# EAGLE design ACCUM (EAGLE 9.3.2)
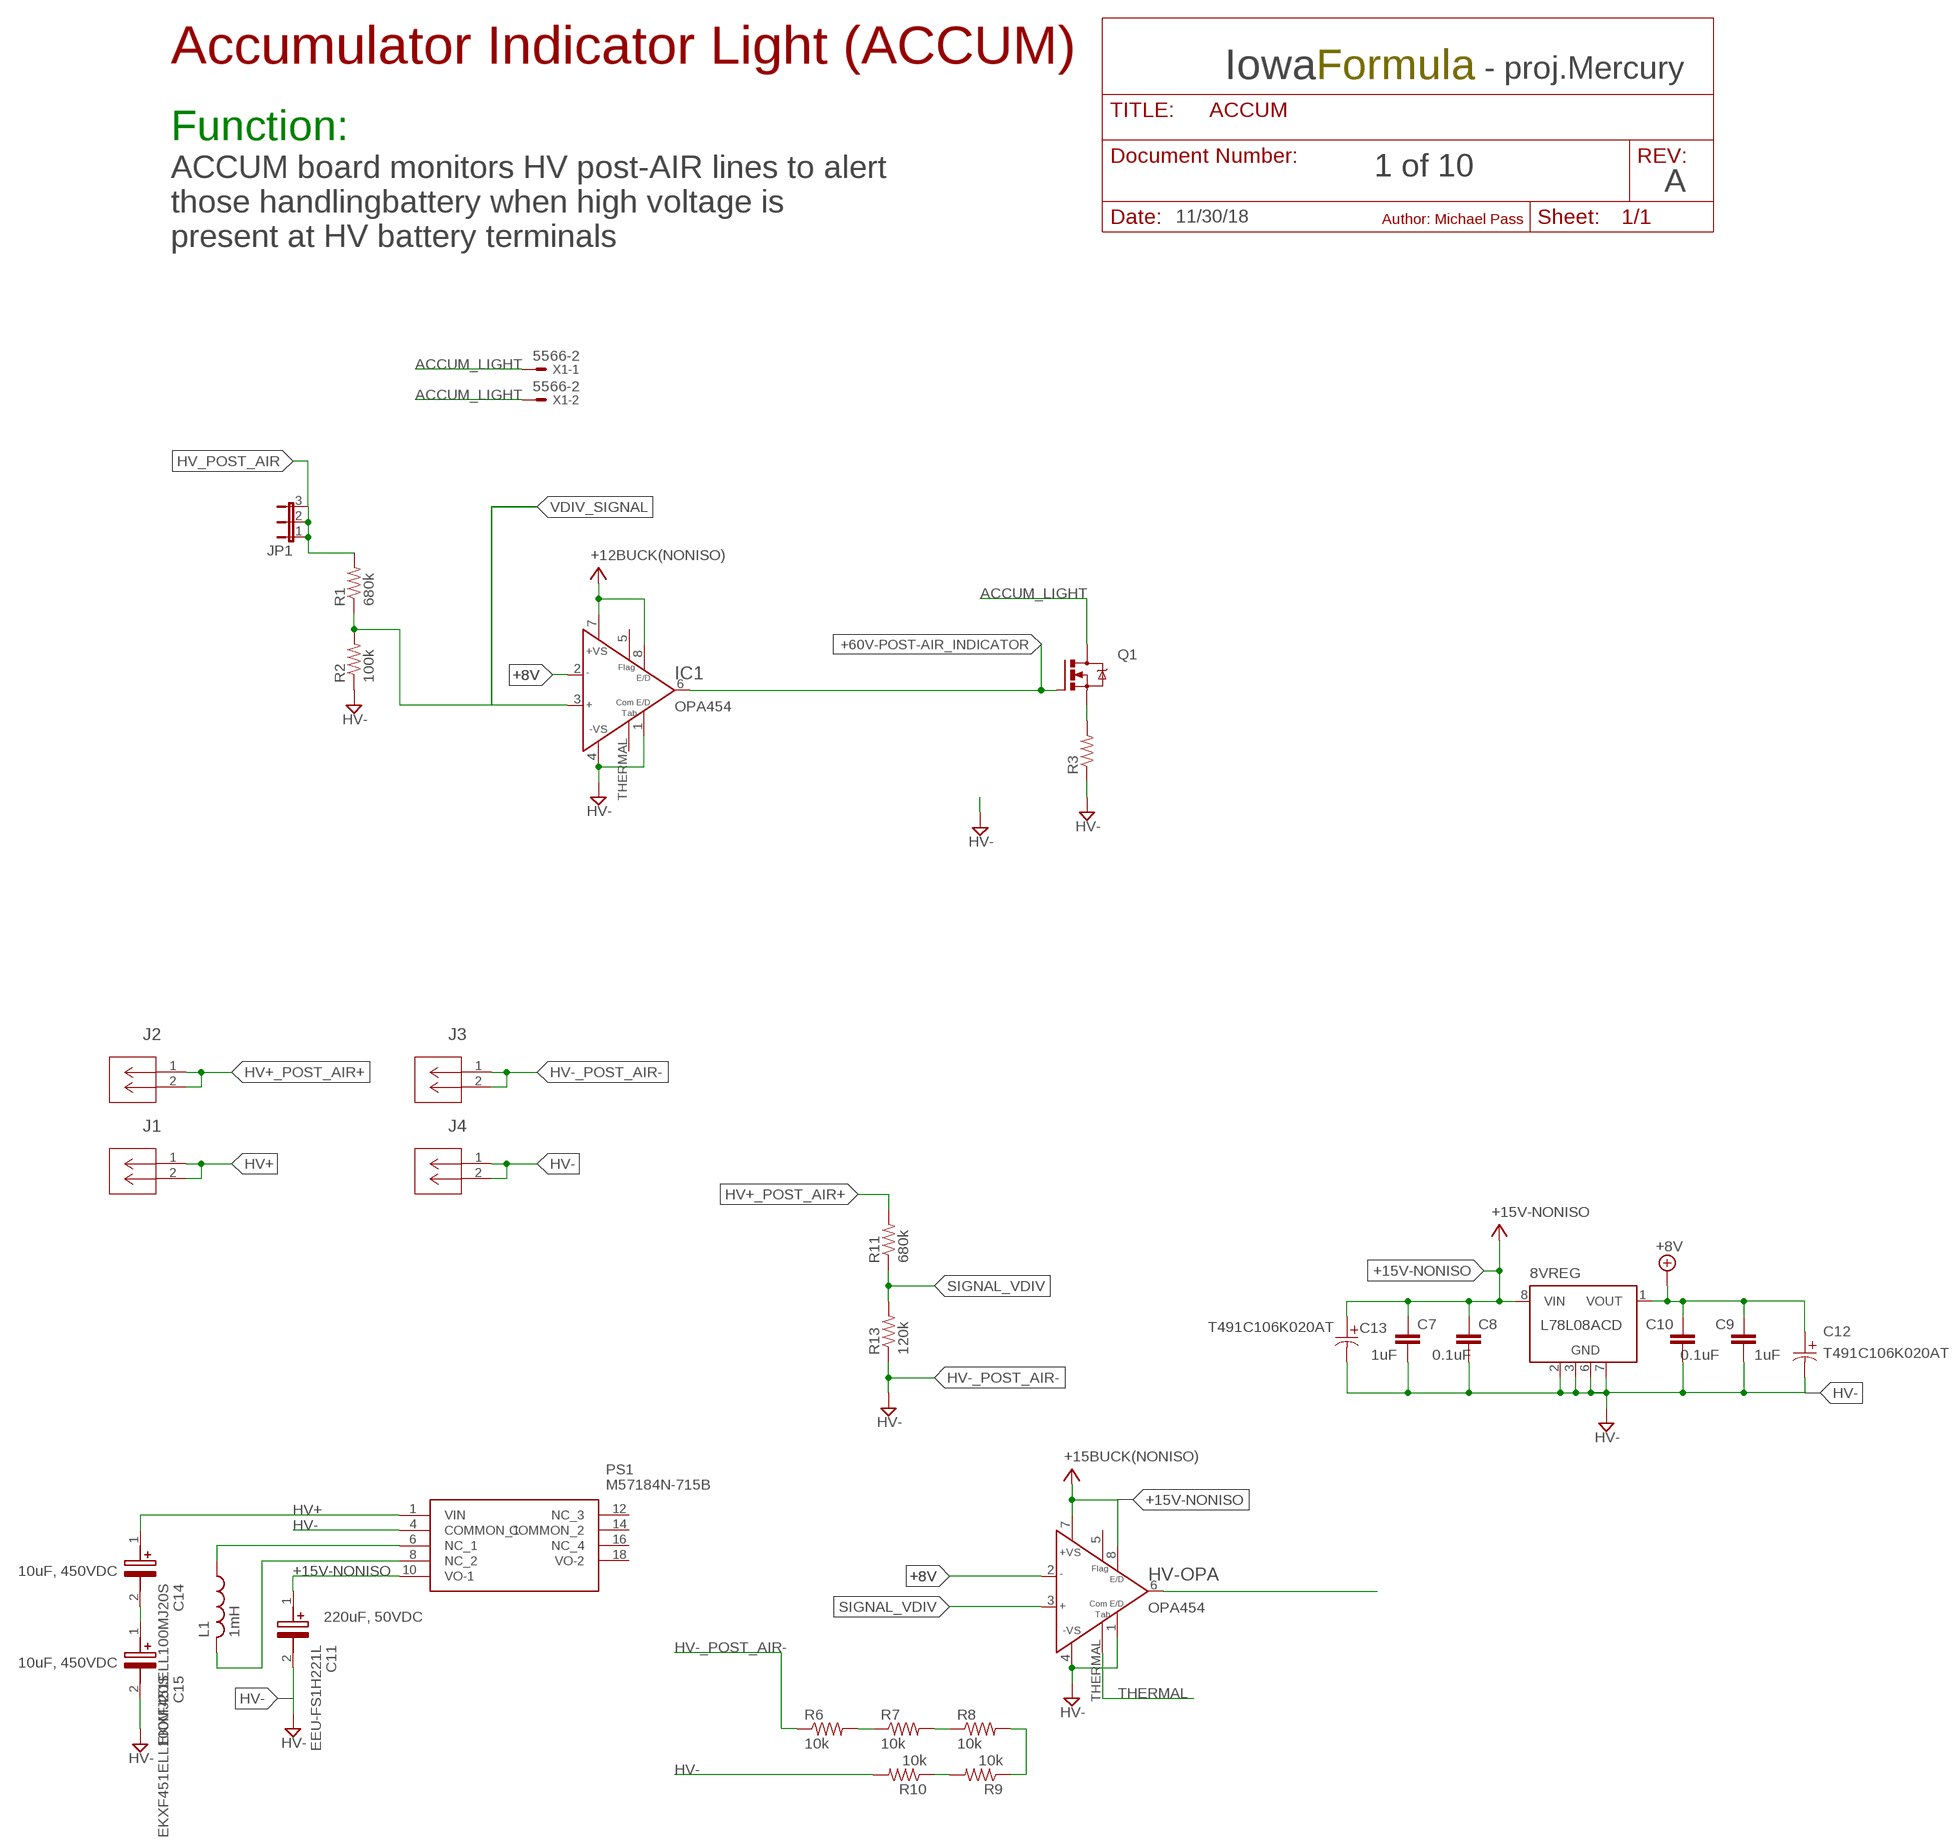
[diagram p0: schematic, sheet 1]

## Parts
8VREG  L78L08ACD  78L08SMD  [SO08]
C7  1uF  C-EUC0805  [C0805]
C8  0.1uF  C-EUC0805  [C0805]
C9  1uF  C-EUC0805  [C0805]
C10  0.1uF  C-EUC0805  [C0805]
C11  EEU-FS1H221L  [CAPPRD350W65D800H2200]
C12  T491C106K020AT  [CAPT6032N]
C13  T491C106K020AT  [CAPT6032N]
C14  EKXF451ELL100MJ20S  [CAPPRD500W60D1025H2150]
C15  EKXF451ELL100MJ20S  [CAPPRD500W60D1025H2150]
HV-OPA  OPA454  [SO08GP]
IC1  OPA454  [SO08GP]
J1  2P_1-770166-0  [CON2_1X2_P163_VMNL-1MTG]
J2  2P_1-770166-0  [CON2_1X2_P163_VMNL-1MTG]
J3  2P_1-770166-0  [CON2_1X2_P163_VMNL-1MTG]
J4  2P_1-770166-0  [CON2_1X2_P163_VMNL-1MTG]
JP1  JP2W  [JP2W]
L1  1mH  L-USL2012C  [L2012C]
PS1  M57184N-715B  [M57184N715B]
Q1  IRLZ44Z  [TO220BH]
R1  680k  R-US_R0805  [R0805]
R2  100k  R-US_R0805  [R0805]
R3  R-US_R0805  [R0805]
R6  10k  R-US_R0805  [R0805]
R7  10k  R-US_R0805  [R0805]
R8  10k  R-US_R0805  [R0805]
R9  10k  R-US_R0805  [R0805]
R10  10k  R-US_R0805  [R0805]
R11  680k  R-US_R0805  [R0805]
R13  120k  R-US_R0805  [R0805]
X1  5566-2  [5566-2]

## Nets
+8V: 8VREG.1(VOUT) C9.1 C10.1 C12.1 HV-OPA.2(IN-) IC1.2(IN-)
+15V-NONISO: 8VREG.8(VIN) C7.1 C8.1 C11.1(+) C13.1 HV-OPA.7(+VS) HV-OPA.8(E/D) PS1.10(VO-1) ; supply symbol labelled +15BUCK(NONISO)
+60V-POST-AIR_INDICATOR: IC1.6(OUT) Q1.G
ACCUM_LIGHT: Q1.D X1.1 X1.2
GND: R2.1 R3.1 ; supply symbol labelled HV-
HV+: C14.1(+) J1.1 J1.2 PS1.1(VIN)
HV+_POST_AIR+: J2.1 J2.2 R11.2
HV-: 8VREG.2(GND) 8VREG.3(GND) 8VREG.6(GND) 8VREG.7(GND) C7.2 C8.2 C9.2 C10.2 C11.2(-) C12.2 C13.2 C15.2(-) HV-OPA.1(E/DCOM) HV-OPA.4(-VS) IC1.1(E/DCOM) IC1.4(-VS) J4.1 J4.2 PS1.4(COMMON_1) R10.2
HV-_POST_AIR-: J3.1 J3.2 R6.1 R13.1 ; supply symbol labelled HV-
HV_POST_AIR: JP1.1 JP1.2 JP1.3 R1.2
N$1: L1.2 PS1.8(NC_2)
N$2: L1.1 PS1.6(NC_1)
N$3: C14.2(-) C15.1(+)
N$4: R7.2 R8.1
N$5: R6.2 R7.1
N$6: Q1.S R3.2
N$7: R8.2 R9.1
N$8: R9.2 R10.1
N$9: HV-OPA.6(OUT)
SIGNAL_VDIV: HV-OPA.3(IN+) R11.1 R13.2
THERMAL: HV-OPA.THERMAL(E/DCOM1)
V+: IC1.7(+VS) IC1.8(E/D) ; supply symbol labelled +12BUCK(NONISO)
VDIV_SIGNAL: IC1.3(IN+) R1.1 R2.2
Unconnected: 8VREG.4(NC) 8VREG.5(NC) HV-OPA.5(STATUS) IC1.5(STATUS) IC1.THERMAL(E/DCOM1) PS1.12(NC_3) PS1.14(COMMON_2) PS1.16(NC_4) PS1.18(VO-2)

## Notes on the sheet
- Accumulator Indicator Light (ACCUM)
- Iowa | Formula | - proj.Mercury
- Function:
- 1 of 10
- A
- 11/30/18 | Author: Michael Pass
- ACCUM board monitors HV post-AIR lines to alert
  those handlingbattery when high voltage is 
  present at HV battery terminals
- 10uF, 450VDC
- 220uF, 50VDC
- 10uF, 450VDC

## Library data of the parts
8VREG = linear:78L*SMD: Positive VOLTAGE REGULATOR
C7-C10 = rcl:C-EU: CAPACITOR, European symbol; SPICEPREFIX: C
C11 = EEU-FS1H221L:EEU-FS1H221L: Aluminum Electrolytic Capacitors - Radial Leaded 50VDC 220uF 9000H 8x20mm Source: Datasheet <https://componentsearchengine.com/Datasheets/1/EEU-FS1H221L.pdf>; DESCRIPTION: Aluminum Electrolytic Capacitors - Radial Leaded 50VDC 220uF 9000H 8x20mm; HEIGHT: 22mm; MANUFACTURER_NAME: Panasonic; MANUFACTURER_PART_NUMBER: EEU-FS1H221L; MOUSER_PART_NUMBER: 667-EEU-FS1H221L; MOUSER_PRICE-STOCK: https://www.mouser.com/Search/Refine.aspx?Keyword=667-EEU-FS1H221L
C12 C13 = T491C106K020AT:T491C106K020AT; MANUFACTURER_PART_NUMBER: T491C106K020AT; VENDOR: Kemet
C14 C15 = EKXF451ELL100MJ20S:EKXF451ELL100MJ20S: Aluminum Electrolytic Capacitors - Radial Leaded 10uF 20% 450V Long Life Source: Datasheet <https://www.mouser.com/datasheet/2/420/United-Chemi-Con-1511290.pdf>; DESCRIPTION: Aluminum Electrolytic Capacitors - Radial Leaded 10uF 20% 450V Long Life; HEIGHT: 21.5mm; MANUFACTURER_NAME: United Chemi-Con (UCC); MANUFACTURER_PART_NUMBER: EKXF451ELL100MJ20S; MOUSER_PART_NUMBER: 661-EKXF451ELL100MJ2
HV-OPA IC1 = OPA454:OPA454: TexasInstruments High-Voltage (100V), High-Current (50mA) Operatioanl Amplifier, G = 1 Stable http://focus.ti.com/lit/ds/symlink/opa454.pdf; AVAILABILITY: Unavailable; DESCRIPTION: High Voltage _100V_ High-Current _50mA_ Operational Amplifiers G=1 Stable; MF: Texas Instruments; MP: OPA454; PACKAGE: None; PRICE: None
J1-J4 = con-MATE-N-LOK:2P_1-770166-0; MANUFACTURER_PART_NUMBER: 17701660; VENDOR: TE Connectivity
JP1 = jumper:JP2W: JUMPER
L1 = rcl:L-US: INDUCTOR, American symbol; SPICEPREFIX: L
PS1 = M57184N-715B:M57184N-715B: High Voltage Input DC-to-DC Converter Source: Datasheet <https://4donline.ihs.com/images/VipMasterIC/IC/PWRX/PWRXS01028/PWRXS01028-1.pdf?hkey=EF798316E3902B6ED9A73243A3159BB0>; DESCRIPTION: High Voltage Input DC-to-DC Converter; HEIGHT: 24.5mm; MANUFACTURER_NAME: POWEREX; MANUFACTURER_PART_NUMBER: M57184N-715B
Q1 = transistor-power:IRLZ44Z: N-Channel HEXFET® Power MOSFET Logic Level AUTOMOTIVE MOSFET Source: http://www.irf.com/product-info/datasheets/data/irlz44zpbf.pdf
R1-R3 R6-R11 R13 = rcl:R-US_: RESISTOR, American symbol; SPICEPREFIX: R
X1 = con-molex:5566-2: Mini FIT connector 2 pol Source: http://www.molex.com; MF: MOLEX; OC_FARNELL: 1822072; OC_NEWARK: unknown

## Board
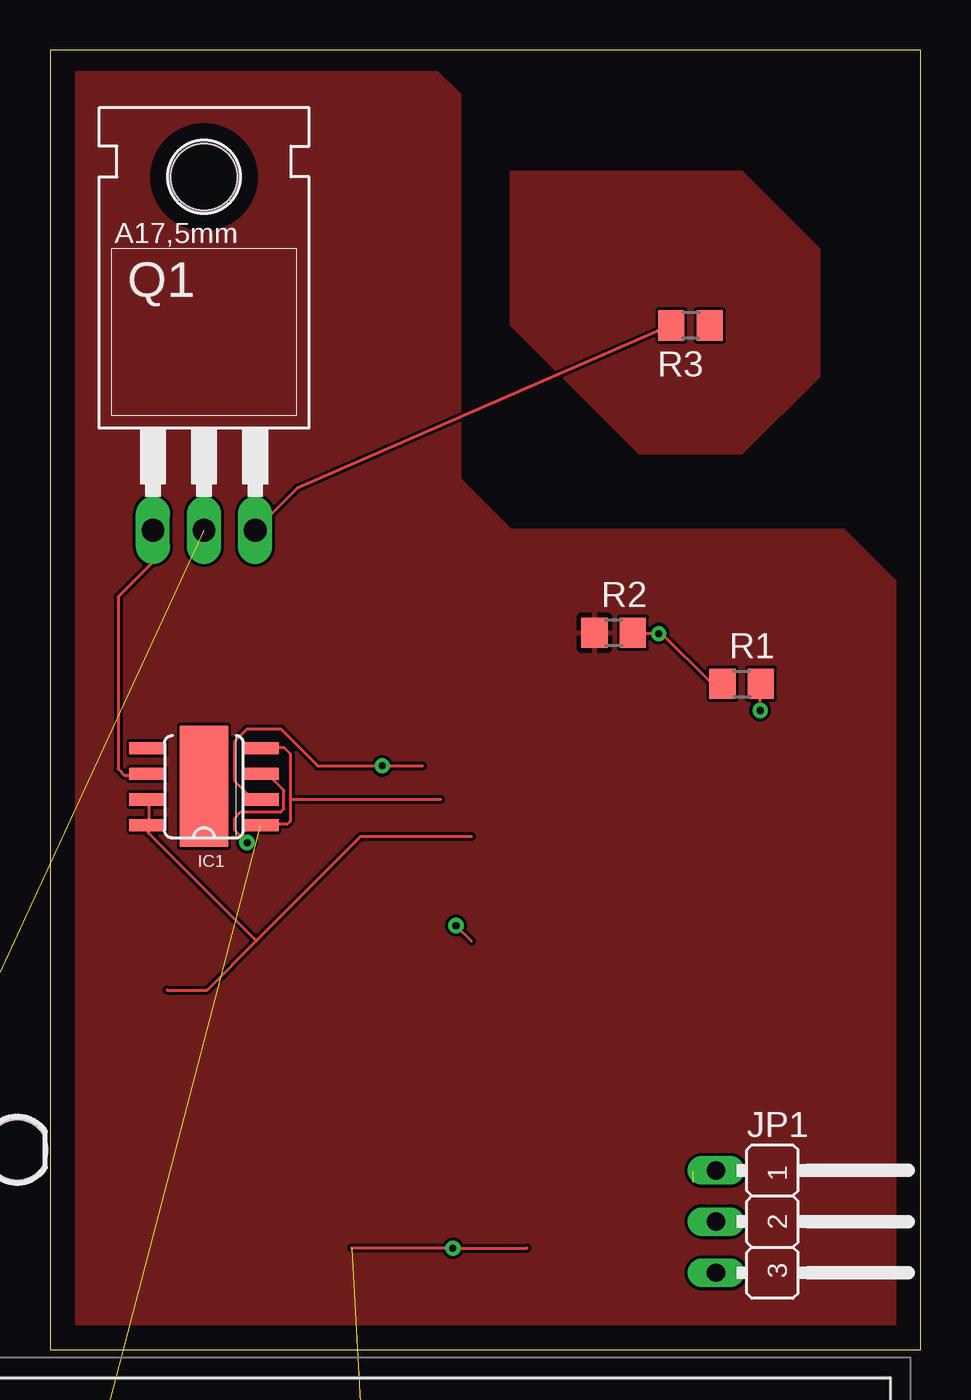
[diagram p1: board, top side]
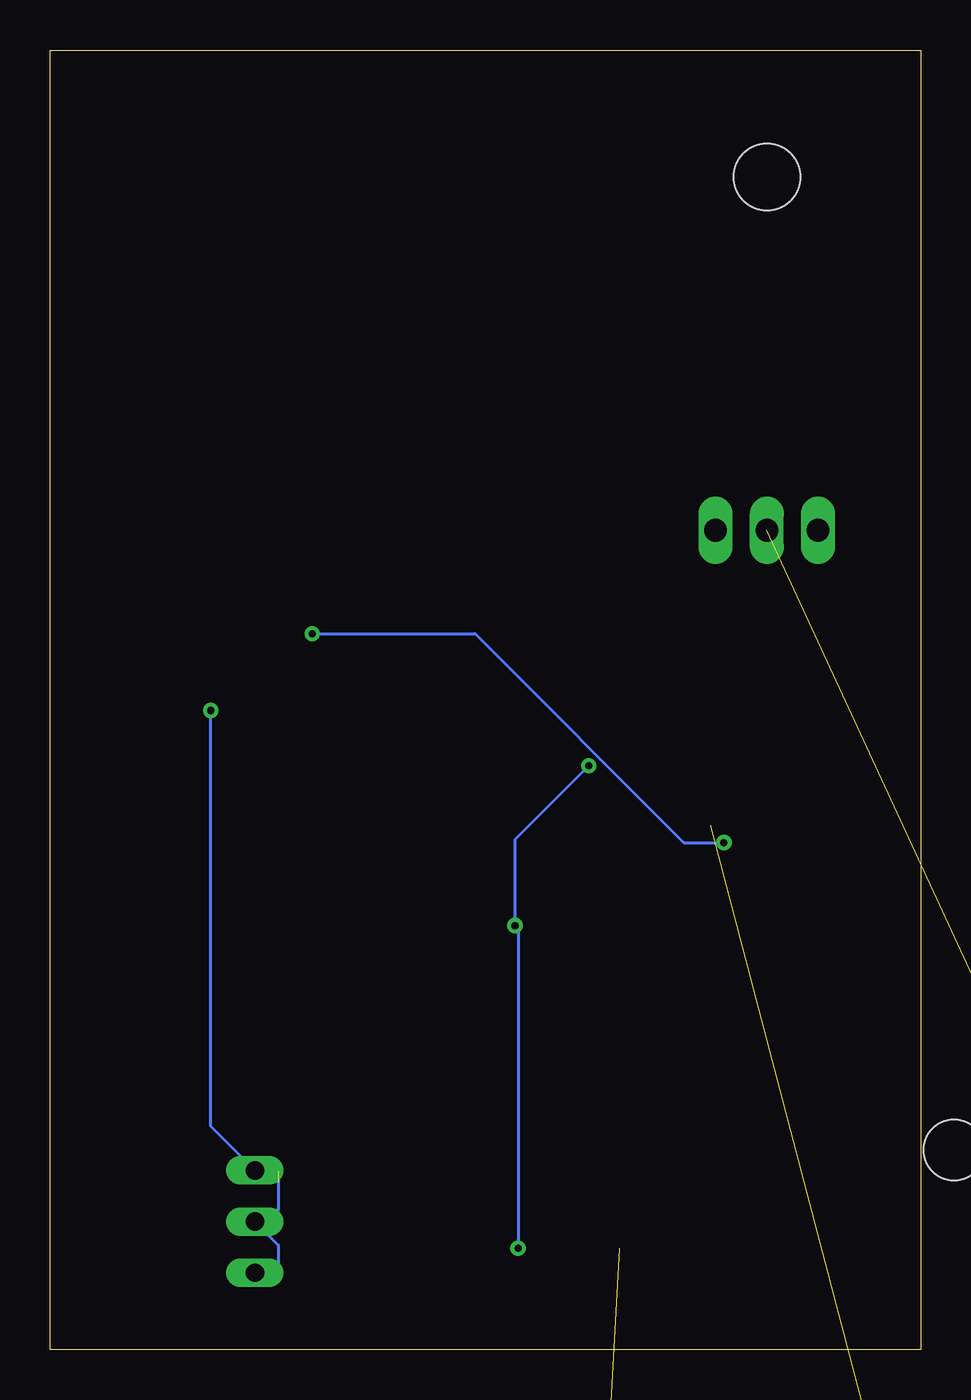
[diagram p2: board, bottom side, seen from below]

Size 43.16 x 64.44 mm. Coordinates in mm from the lower left corner, seen from the top.
Outline: 0,0 43.16,0 43.16,64.44 0,64.44 0,0
Copper layers (1*16): Top 0.035mm / dielectric 1.5mm / Bottom 0.035mm
Design rules "default": minimum track width 6mil, minimum drill 0.35mm, track to track 6mil, track to pad 6mil, pad to pad 6mil, via to via 6mil, smd to smd 6mil, copper to edge 40mil, drill to drill 6mil, minimum pad ring 10mil, minimum via ring 8mil, stop-mask expansion 4mil, vias tented up to drill 0mil, thermal gap 10mil

### Footprints (pad centres in the part's own frame; a part is rotated, then mirrored left to right if it is on the bottom)
SO08 = smd 0.6 x 2.2: 1 -1.905,-2.6; 2 -0.635,-2.6; 3 0.635,-2.6; 4 1.905,-2.6; 5 1.905,2.6; 6 0.635,2.6; 7 -0.635,2.6; 8 -1.905,2.6
C0805 = smd 1.3 x 1.5: 1 -0.95,0; 2 0.95,0
CAPPRD350W65D800H2200 = drill 0.85 pad 1.275 square: 1 0,0 | drill 0.85 pad 1.275: 2 3.5,0
CAPT6032N = smd 2.26 x 2.2: 1 -2.022,0; 2 2.022,0
CAPPRD500W60D1025H2150 = drill 0.8 pad 1.2 square: 1 0,0 | drill 0.8 pad 1.2: 2 5,0
SO08GP = smd 0.6 x 1.8: 1 -1.925,-2.8; 2 -0.655,-2.8; 3 0.615,-2.8; 4 1.885,-2.8; 5 1.885,2.8; 6 0.615,2.8; 7 -0.655,2.8; 8 -1.925,2.8 | smd 6 x 2.4: THERMAL 0,0
CON2_1X2_P163_VMNL-1MTG = drill 1.397 pad 1.905: 1 0,0; 2 4.14,0 | drill 3.175 pad 3.175: 3 8.585,0
JP2W = drill 0.914 long: 1 -2.54,-1.27; 2 0,-1.27; 3 2.54,-1.27
L2012C = smd 1 x 1: 1 -1,0; 2 1,0
M57184N715B = drill 1.05 pad 1.575: 1 0,0; 4 7.62,0; 6 12.7,0; 8 17.78,0; 10 22.86,0; 12 27.94,0; 14 33.02,0; 16 38.1,0; 18 43.18,0
TO220BH = drill 1.118 long: D 0,-6.35; G -2.54,-6.35; S 2.54,-6.35 | hole 3.302: 0,11.176
R0805 = smd 1.3 x 1.5: 1 -0.95,0; 2 0.95,0
5566-2 = drill 1.4 square: 1 0,-2.75; 2 0,2.75 | hole 3: 4.7,2.29; -4.7,2.29

### Placement (x,y rotation side)
8VREG  -7.62,-24.13 0 top  (outside the outline)
C7  10.16,-54.61 0 top  (outside the outline)
C8  -10.16,-48.26 0 top  (outside the outline)
C9  15.24,-54.61 0 top  (outside the outline)
C10  -3.81,-48.26 0 top  (outside the outline)
C11  -5.08,-33.02 0 top  (outside the outline)
C12  31.75,-53.34 0 top  (outside the outline)
C13  22.86,-53.34 0 top  (outside the outline)
C14  7.62,-20.32 0 top  (outside the outline)
C15  29.21,-20.32 0 top  (outside the outline)
HV-OPA  17.78,-31.75 0 top  (outside the outline)
IC1  7.62,27.94 90 top
J1  26.67,-31.75 0 top  (outside the outline)
J2  -7.62,-41.91 0 top  (outside the outline)
J3  7.62,-41.91 0 top  (outside the outline)
J4  22.86,-41.91 0 top  (outside the outline)
JP1  34.29,6.35 270 top
L1  33.02,-48.26 0 top  (outside the outline)
PS1  -6.35,-8.89 0 top  (outside the outline)
Q1  7.62,46.99 0 top
R1  34.29,33.02 0 top
R2  27.94,35.56 0 top
R3  31.75,50.8 180 top
R6  -10.16,-54.61 0 top  (outside the outline)
R7  -5.08,-54.61 0 top  (outside the outline)
R8  0,-54.61 0 top  (outside the outline)
R9  5.08,-54.61 0 top  (outside the outline)
R10  15.24,-48.26 0 top  (outside the outline)
R11  2.54,-48.26 0 top  (outside the outline)
R13  8.89,-48.26 0 top  (outside the outline)
X1  -6.35,7.62 0 top

### Tracks (layer width: path | path; a pad name or v marks a point on that pad's centre or on a via)
+8V  (via drill 0.35)  (5 unrouted)
  Top 0.152: 14.94,5.03 v19.96,5.03 23.63,5.03 | 18.47,28.96 v16.46,28.96 13.26,28.96 11.43,30.79 9.75,30.79 9.14,30.18 9.14,28.19 9.91,27.43 10.36,27.43 IC1.2 | v20.12,21.03 20.88,20.27
  Bottom 0.152: v16.46,28.96 20.12,25.3 v20.12,21.03 19.96,20.88 v19.96,5.03
+15V-NONISO  (7 unrouted)
+60V-POST-AIR_INDICATOR
  Top 0.152: IC1.6 4.72,28.5 3.66,28.5 3.35,28.8 3.35,37.34 5.03,39.01 5.03,40.54 Q1.G
ACCUM_LIGHT  (2 unrouted)
GND
  pour Top: 1.27,63.5 1.27,1.27 19.05,1.27 41.91,1.27 41.91,24.13 41.91,38.1 39.37,40.64 22.86,40.64 20.32,43.18 20.32,62.23 19.05,63.5
HV+  (3 unrouted)
HV+_POST_AIR+  (2 unrouted)
HV-  (18 unrouted)
  Top 0.152: 11.89,27.28 11.89,29.57 11.58,29.87 10.52,29.87 IC1.4 | 11.89,27.28 11.89,26.21 11.73,26.06 10.52,26.06 IC1.1 | 19.34,27.28 11.89,27.28
HV-_POST_AIR-  (3 unrouted)
HV_POST_AIR  (via drill 0.35)  (1 unrouted)
  Top 0.152: v35.2,31.7 35.2,32.92 R1.2
  Bottom 0.152: JP1.3 31.85,3.81 31.85,5.18 JP1.2 31.85,6.93 31.85,8.84 | v35.2,31.7 35.2,11.07 JP1.1 31.85,8.31
N$1  (1 unrouted)
N$2  (1 unrouted)
N$3  (1 unrouted)
N$4  (1 unrouted)
N$5  (1 unrouted)
N$6
  Top 0.152: R3.2 12.25,42.73 Q1.S
N$7  (1 unrouted)
N$8  (1 unrouted)
SIGNAL_VDIV  (2 unrouted)
V+
  Top 0.152: IC1.7 4.88,27.28 4.88,26.06 IC1.8 4.88,25.91 4.88,25.6 10.21,20.27 | 20.88,25.45 15.39,25.45 10.21,20.27 | 10.21,20.27 7.77,17.83 5.79,17.83
VCC
  pour Top: 22.86,58.42 34.29,58.42 38.1,54.61 38.1,48.26 34.29,44.45 29.21,44.45 22.86,50.8
VDIV_SIGNAL  (via drill 0.35)
  Top 0.152: R2.2 28.96,35.51 v30.18,35.51 30.33,35.51 32.77,33.07 33.22,33.07 R1.1 | v9.75,25.15 9.14,25.76 9.14,26.36 9.45,26.67 11.43,26.67 11.58,26.82 11.58,27.74 10.82,28.5 10.52,28.5 IC1.3
  Bottom 0.152: v9.75,25.15 11.73,25.15 22.1,35.51 v30.18,35.51